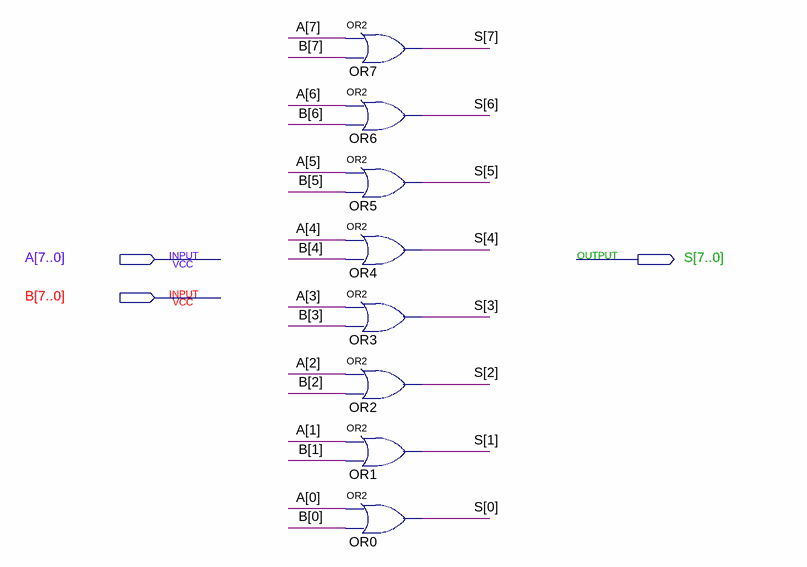
[diagram p0: schematic sheet]
// Quartus schematic OR_8b.bdf as structural Verilog: 8 symbols, 3 pins
module OR_8b (
  input  [7:0] A,
  input  [7:0] B,
  output [7:0] S
);

  or OR7 (S[7], A[7], B[7]);
  or OR6 (S[6], A[6], B[6]);
  or OR5 (S[5], A[5], B[5]);
  or OR4 (S[4], A[4], B[4]);
  or OR3 (S[3], A[3], B[3]);
  or OR2 (S[2], A[2], B[2]);
  or OR1 (S[1], A[1], B[1]);
  or OR0 (S[0], A[0], B[0]);
endmodule
